# Altium schematic sheet fram_rtc.SchDoc: Triumvi - MCU - FRAM, RTC
size Letter; Author: Ye-Sheng Kuo; Revision: 9; SheetNumber: 4; SheetTotal: 5
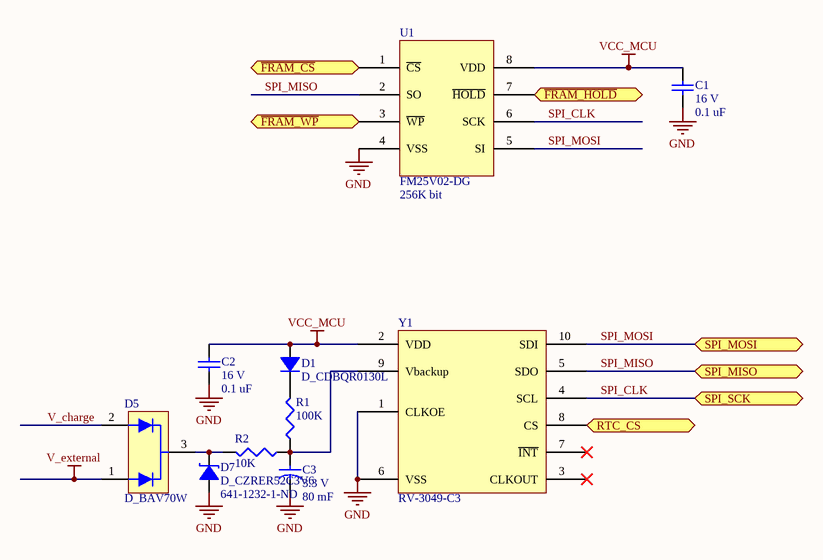
[diagram p0: fram_rtc.SchDoc]

## Parts
C1  value 0.1 uF  voltage rated: 16 V  [0402]  (hidden comment: Ceramic capacitor)
C2  value 0.1 uF  voltage rated: 16 V  [0402]  (hidden comment: Ceramic capacitor)
C3  value 80 mF  voltage rated: 3.3 V  [XH414HG-IV01E]  (hidden comment: Electric Double Layer Capacitors)
D1  D_CDBQR0130L  [0402 - DIODE]
D5  D_BAV70W  [SOT323]
D7  D_CZRER52C3V6  Supplier Part Number 1: 641-1232-1-ND  [0503/SOD-723F]
R1  value 100K  [0402]  (hidden comment: Chip resistor)
R2  value 10K  [0402]  (hidden comment: Chip resistor)
U1  FM25V02-DG  Size: 256K bit  [TDFN-8]
Y1  RV-3049-C3  [RV-3049-C3]

## Ports
RTC_CS, SPI_MISO, SPI_MOSI, SPI_SCK, ~{FRAM_CS}, ~{FRAM_HOLD}, ~{FRAM_WP}

## Nets
GND: C1.2 C2.2 C3.2 D7.1 U1.4(VSS) Y1.1(CLKOE) Y1.6(VSS)
V_external: D5.1
VCC_MCU: C1.1 C2.1 D1.1 U1.8(VDD) Y1.2(VDD)
~{FRAM_CS}: U1.1(~{CS}) ; port ~{FRAM_CS}
~{FRAM_HOLD}: U1.7(~{HOLD}) ; port ~{FRAM_HOLD}
~{FRAM_WP}: U1.3(~{WP}) ; port ~{FRAM_WP}
RTC_CS: Y1.8(CS) ; port RTC_CS
SPI_CLK: U1.6(SCK) Y1.4(SCL) ; port SPI_SCK
SPI_MISO: U1.2(SO) Y1.5(SDO) ; port SPI_MISO
SPI_MOSI: U1.5(SI) Y1.10(SDI) ; port SPI_MOSI
V_charge: D5.2
NetC3_1: C3.1 R1.2 R2.2 Y1.9(Vbackup)
NetD1_2: D1.2 R1.1
NetD5_3: D5.3 D7.2 R2.1

Not connected (* = marked no-connect by the designer): Y1 3(CLKOUT)* 7(~{INT})*

## Notes on the sheet
- Title
- Date:
- Author:
- Revision:
- Sheet
- of
- University of Michigan
- File:

## Library data of the parts
C1 C2 = C_0.1u_16V_0402_ceramic: Ceramic capacitor, 0.1u, 16 V, 0402 package; Manufacture: Murata; tolerance: 10%; Temperature Coef: X7R; package: 0402; Supplier 1: Digi-Key; Supplier Part Number 1: 490-3261-1-ND
C3 = C_80m_3.3V_supercap: Manufacture: Seiko Instruments; Supplier 1: Digi-Key; Supplier Part Number 1: 728-1050-1-ND
D1 = D_CDBQR0130L: SMD Schottky Barrier Diode; package: 0402; Supplier 1: Digi-Key; Supplier Part Number 1: 641-1271-1-ND
D5 = D_BAV70W: DUAL SURFACE MOUNT SWITCHING DIODE; Supplier 1: Digi-Key; Supplier Part Number 1: BAV70W-FDICT-ND
D7 = D_CZRER52C3V6: SURFACE MOUNT ZENER DIODE; package: 0603; Supplier 1: Digi-Key
R1 = R_100K_0402: Chip resistor, 100K, 0402 package; tolerance: 1%; power: 1/16 W; Supplier 1: Digi-Key; Supplier Part Number 1: 541-100KLCT-ND; package: 0402
R2 = R_10K_0402: Chip resistor, 10K, 0402 package; tolerance: 1%; power: 1/16 W; Supplier 1: Digi-Key; Supplier Part Number 1: 541-10.0KLCT-ND; package: 0402
U1 = FM25V02-DG: 256-Kbit (32 K × 8) Serial (SPI) F-RAM; Supplier 1: Digi-Key; Supplier Part Number 1: FM25V02-DGRA-ND
Y1 = RV-3049-C3: Real Time Clock Module with SPI-Bus